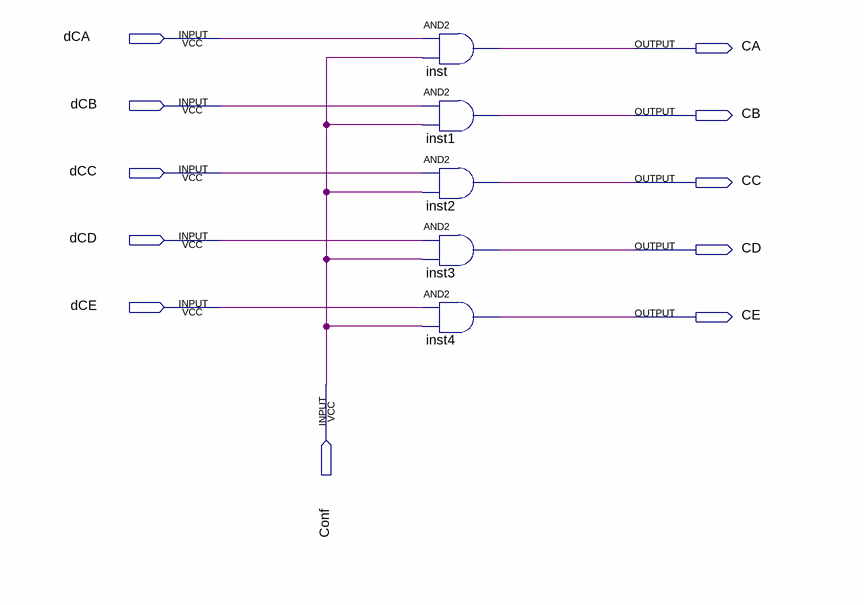
[diagram p0: schematic sheet]
// Quartus schematic Confirmador.bdf as structural Verilog: 5 symbols, 11 pins
module Confirmador (
  input  dCA,
  input  dCB,
  input  dCC,
  input  dCD,
  input  dCE,
  input  Conf,
  output CA,
  output CB,
  output CC,
  output CD,
  output CE
);

  and inst (CA, dCA, Conf);
  and inst1 (CB, dCB, Conf);
  and inst2 (CC, dCC, Conf);
  and inst3 (CD, dCD, Conf);
  and inst4 (CE, dCE, Conf);
endmodule
